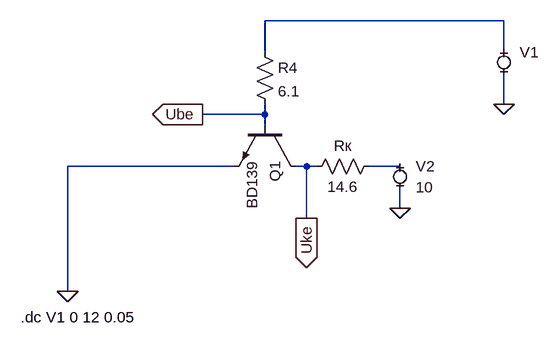
[diagram p0: schematic Key_NPN.asc]
Key_NPN.asc, the LTspice schematic file:
Version 4
SHEET 1 880 680
WIRE 352 0 -16 0
WIRE -16 48 -16 0
WIRE 352 48 352 0
WIRE 352 128 352 80
WIRE -16 144 -16 128
WIRE -16 144 -112 144
WIRE -16 160 -16 144
WIRE -64 224 -320 224
WIRE 48 224 32 224
WIRE 64 224 48 224
WIRE 192 224 144 224
WIRE 192 288 192 256
WIRE 48 304 48 224
WIRE -320 416 -320 224
FLAG 352 128 0
FLAG -320 416 0
FLAG 192 288 0
FLAG 48 304 Uke
IOPIN 48 304 Out
FLAG -112 144 Ube
IOPIN -112 144 Out
SYMBOL npn 32 160 R90
SYMATTR InstName Q1
SYMATTR Value BD139
SYMBOL res -32 32 R0
SYMATTR InstName R4
SYMATTR Value 6.1
SYMBOL MiniSyms4\\voltage- 352 64 R0
WINDOW 123 0 0 Left 2
WINDOW 39 0 0 Left 2
SYMATTR InstName V1
SYMATTR Value ""
SYMBOL res 160 208 R90
WINDOW 0 0 56 VBottom 2
WINDOW 3 32 56 VTop 2
SYMATTR InstName Rк
SYMATTR Value 14.6
SYMBOL MiniSyms4\\voltage- 192 240 R0
WINDOW 123 0 0 Left 2
WINDOW 39 0 0 Left 2
SYMATTR InstName V2
SYMATTR Value 10
TEXT -392 456 Left 2 !.dc V1 0 12 0.05

The netlist it stands for:
* Key_NPN.asc
Q1 Uke Ube 0 0 BD139
R4 N001 Ube 6.1
V1 N001 0
Rк N002 Uke 14.6
V2 N002 0 10
.model NPN NPN
.model PNP PNP
.lib standard.bjt
.dc V1 0 12 0.05
.backanno
.end